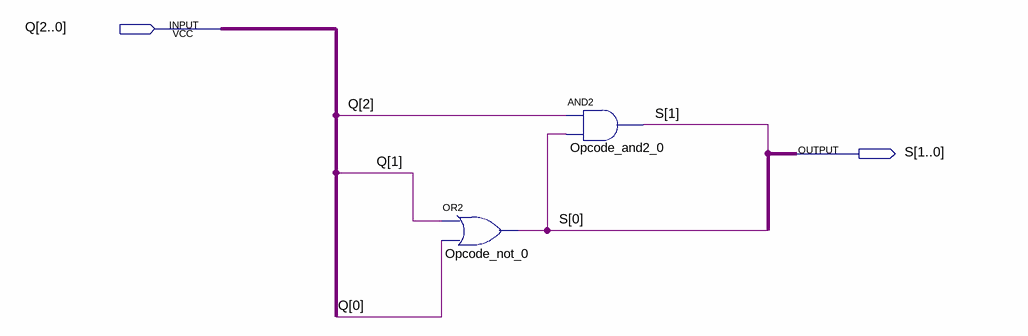
[diagram p0: schematic sheet]
// Quartus schematic Opcode.bdf as structural Verilog: 2 symbols, 2 pins
module Opcode (
  input  [2:0] Q,
  output [1:0] S
);

  or Opcode_not_0 (S[0], Q[1], Q[0]);
  and Opcode_and2_0 (S[1], Q[2], S[0]);
endmodule
